# EAGLE design LB_BIT_WIRE-v03(1_1x) (EAGLE 6.5.0)
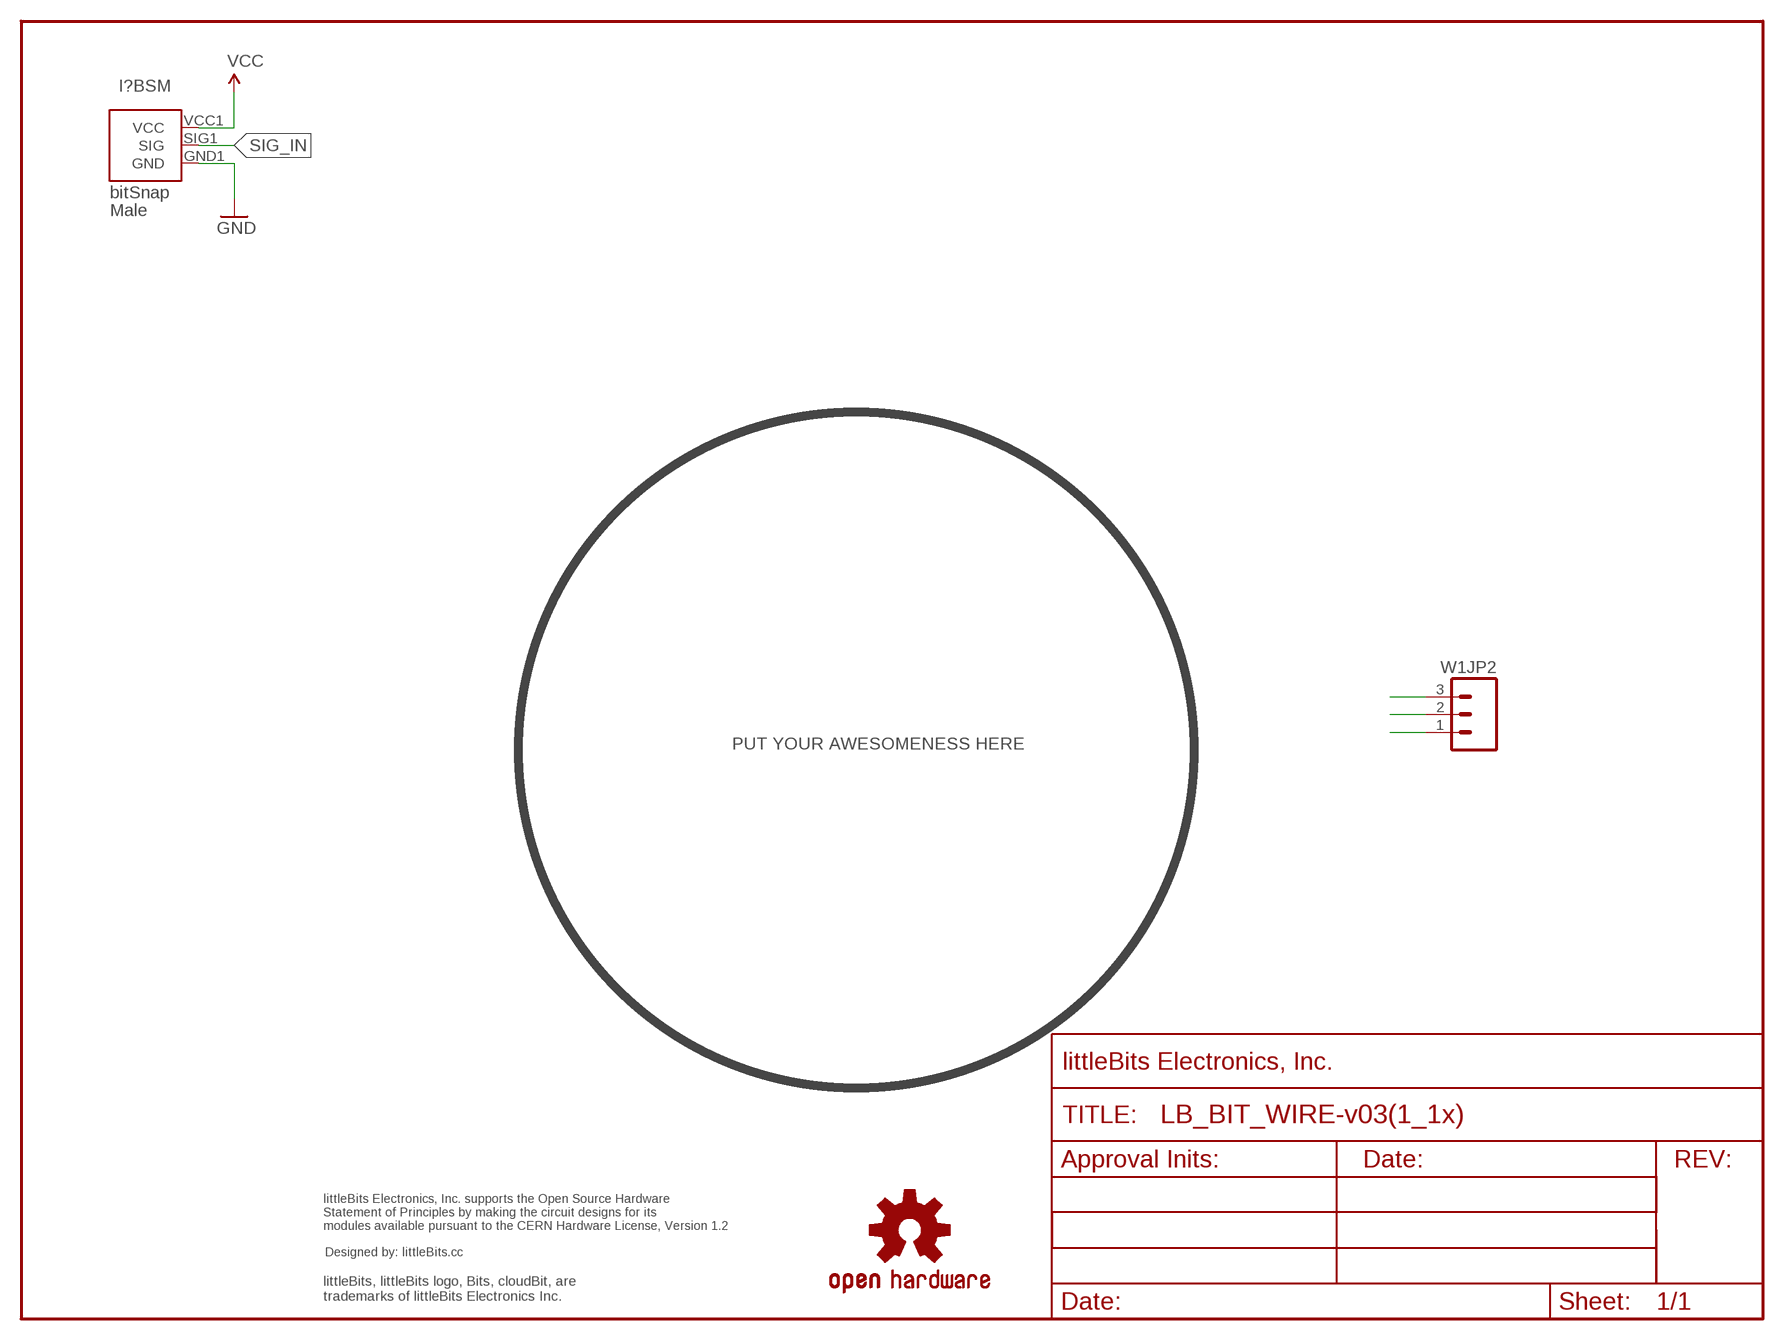
[diagram p0: schematic, sheet 1]

## Parts
FRAME1  FRAME-LETTER  [FABDWG01-OHW]
I?BSM  BITSNAP_V03_MALE  [BITSNAP_V03_MALE]
U$2  OSHWCREDIT  [OSHWCREDIT]
U$5  OSHW-LOGOL  [OSHW-LOGO-L]
W1JP2  M03SMD  [1X03-1MM-RA]

## Nets
GND: I?BSM.GND1(GND) W1JP2.1
SIG: W1JP2.2
SIG_IN: I?BSM.SIG1(SIG)
VCC: I?BSM.VCC1(VCC) W1JP2.3

## Notes on the sheet
- PUT YOUR AWESOMENESS HERE

## Library data of the parts
FRAME1 = LITTLEBITS:FRAME-LETTER
I?BSM = bitSnap:BITSNAP_V03_MALE
U$2 = LITTLEBITS:OSHWCREDIT
U$5 = LITTLEBITS131206:OSHW-LOGO: Open Source Hardware Logo This logo indicates the piece of hardware it is found on incorporates a OSHW license and/or adheres to the definition of open source hardware found here: http://freedomdefined.org/OSHW
W1JP2 = SparkFun:M03: Header 3 Standard 3-pin 0.1" header. Use with straight break away headers (SKU : PRT-00116), right angle break away headers (PRT-00553), swiss pins (PRT-00743), machine pins (PRT-00117), and female headers (PRT-00115). Molex polarized connector foot print use with SKU : PRT-08232 with associated crimp pins and housings.

## Board
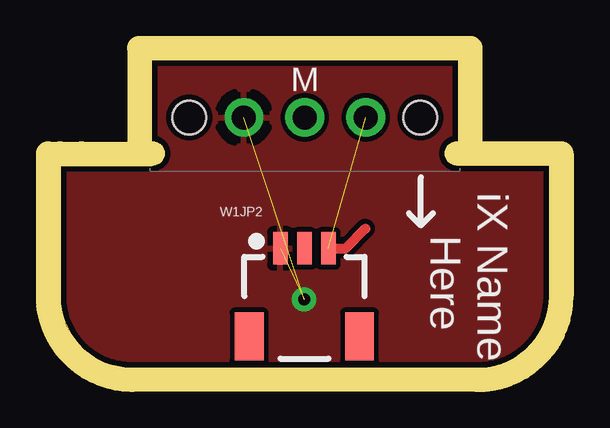
[diagram p1: board, top side]
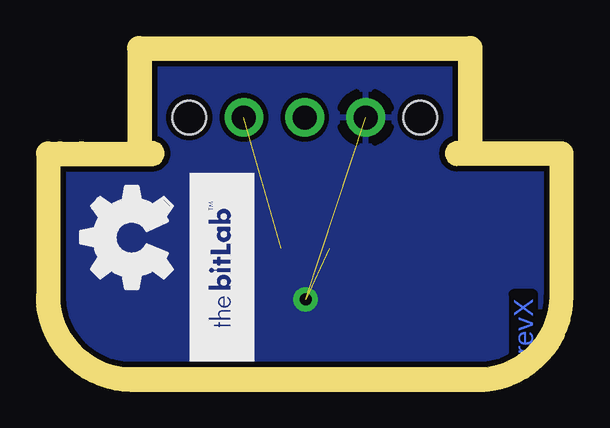
[diagram p2: board, bottom side, seen from below]

Size 20.4 x 12.85 mm. Coordinates in mm from the lower left corner, seen from the top.
Outline: 0,8.45 0,3 arc90 3,0 17.4,0 arc90 20.4,3 20.4,8.45
Copper layers (1*16): Top 0.035mm / dielectric 1.5mm / Bottom 0.035mm
Design rules "default": minimum track width 8mil, minimum drill 20mil, track to track 8mil, track to pad 8mil, pad to pad 8mil, via to via 8mil, smd to smd 8mil, copper to edge 10mil, drill to drill 8mil, minimum pad ring 12mil, minimum via ring 10mil, stop-mask expansion 4mil, vias tented up to drill 25mil, thermal gap 10mil
Milling: 7 lines

### Footprints (pad centres in the part's own frame; a part is rotated, then mirrored left to right if it is on the bottom)
BITSNAP_V03_MALE = drill 1: GND1 9.145,2.61; SIG1 6.605,2.61; VCC1 4.065,2.61 | hole 1.4: 1.785,2.61; 11.425,2.61
1X03-1MM-RA = smd 0.6 x 1.35: 1 -1,0; 2 0,0; 3 1,0 | smd 1.2 x 2: NC1 2.3,-3.675; NC2 -2.3,-3.675

### Placement (x,y rotation side)
FRAME1  -3.01,-0.15 0 top  (outside the outline)
I?BSM  16.8,13.06 180 top
U$1  [BITLAB-LOGO]  12.31,8.12 270 top
U$2  -96.87,-61.39 0 top  (outside the outline)
U$4  [OSHW_FILLX150_NOTEXT]  15.73,2.49 0 top
U$5  -38.85,-66.5 0 top  (outside the outline)
W1JP2  10.18,4.99 0 top

### Tracks (layer width: path | path; a pad name or v marks a point on that pad's centre or on a via)
GND  (via drill 0.5)  (2 unrouted)
  other vias: 10.17,2.86
  pour Top: 0.12,0.06 0.12,12.75 20.24,12.75 20.24,0.06
  pour Bottom: 0.12,0.06 0.12,12.71 20.22,12.71 20.22,0.06
VCC  (1 unrouted)
  Top 0.406: W1JP2.3 11.9,4.99 12.72,5.81

### Text on the board
Bottom: revX
tPlace: iX Name / Here
Milling: 1mm DIA. ROUTER PATH